# Altium schematic sheet ESP32-C3 Module.SchDoc
size A3; Author: Alptron AB; CompanyName: Alptron AB; DrawnBy: Caner Alp; Engineer: Caner Alp; Organization: Alptron AB; Address2: Vaesteas; Address4: Sweden; DocumentNumber: 2; SheetNumber: 2; SheetTotal: 5
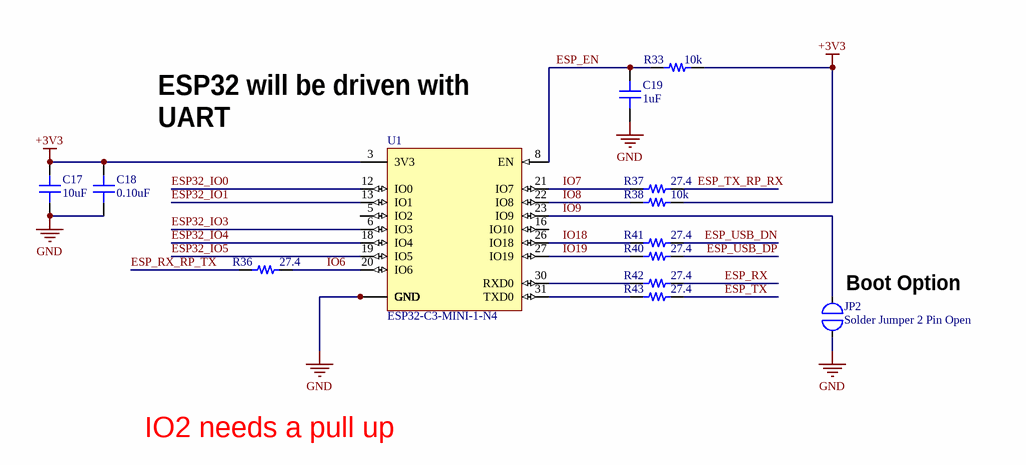
[diagram p0: ESP32-C3 Module.SchDoc]

## Parts
C17  10uF  [CAP 0603/1608]
C18  0.10uF  [CAP 0402/1005]
C19  1uF  [CAP 0402/1005]
JP2  Solder Jumper 2 Pin Open  [SolderJumper-2_P1.3mm_Open_RoundedPad1.0x1.5mm]  (net tie, no BOM)
R33  10k  [RES 0402/1005]
R36  27.4  [RES 0402/1005]
R37  27.4  [RES 0402/1005]
R38  10k  [RES 0402/1005]
R40  27.4  [RES 0402/1005]
R41  27.4  [RES 0402/1005]
R42  27.4  [RES 0402/1005]
R43  27.4  [RES 0402/1005]
U1  ESP32-C3-MINI-1-N4  [XCVR_ESP32-C3-MINI-1-N4]

## Nets
+3V3: C17.2 C18.2 R33.2 R38.2 U1.3(3V3)
GND: C17.1 C18.1 C19.1 JP2.1(A) U1.1(GND) U1.2(GND) U1.11(GND) U1.14(GND) U1.36(GND) U1.37(GND) U1.38(GND) U1.39(GND) U1.40(GND) U1.41(GND) U1.42(GND) U1.43(GND) U1.44(GND) U1.45(GND) U1.46(GND) U1.47(GND) U1.48(GND) U1.49_1(GND) U1.49_2(GND) U1.49_3(GND) U1.49_4(GND) U1.49_5(GND) U1.49_6(GND) U1.49_7(GND) U1.49_8(GND) U1.49_9(GND) U1.50(GND) U1.51(GND) U1.52(GND) U1.53(GND)
ESP32_IO0: U1.12(IO0)
ESP32_IO1: U1.13(IO1)
ESP32_IO3: U1.6(IO3)
ESP32_IO4: U1.18(IO4)
ESP32_IO5: U1.19(IO5)
ESP_EN: C19.2 R33.1 U1.8(EN)
ESP_RX: R42.2
ESP_RX_RP_TX: R36.1
ESP_TX: R43.2
ESP_TX_RP_RX: R37.2
ESP_USB_DN: R41.2
ESP_USB_DP: R40.2
IO6: R36.2 U1.20(IO6)
IO7: R37.1 U1.21(IO7)
IO8: R38.1 U1.22(IO8)
IO9: JP2.2(B) U1.23(IO9)
IO18: R41.1 U1.26(IO18)
IO19: R40.1 U1.27(IO19)
NetR42_1: R42.1 U1.30(RXD0)
NetR43_1: R43.1 U1.31(TXD0)

Not connected (* = marked no-connect by the designer): U1 4(NC) 5(IO2) 7(NC) 9(NC) 10(NC) 15(NC) 16(IO10) 17(NC) 24(NC) 25(NC) 28(NC) 29(NC) 32(NC) 33(NC) 34(NC) 35(NC)

## Notes on the sheet
- (near U1) ESP32 will be driven with UART
- (near JP2) Boot Option
- IO2 needs a pull up
- Title:
- Project:
- Document Number:
- Variant:
- Revision:
- Drawn By:
- Date:
- Sheet
- of
- Size:
- A3

## Library data of the parts
C17 = GRM188R60J106ME47D: CAP CER 10UF 6.3V X5R 0603; Manufacturer: Murata Electronics North America; TemperatureRange: -55C ~ 85C; Tolerance: 20%; Value: 10uF; Part Number: GRM188R60J106ME47D; PartId: 12950; Supplier 1: Digi-Key; Supplier Part Number 1: 490-3896-2-ND; ComponentLink1Description: Datasheet; ComponentLink1URL: http://www.murata.com/~/media/webrenewal/support/library/catalog/products/capacitor/mlcc/c02e.pdf; ComponentLink2Description: Digi-Key Listing; ComponentLink2URL: https://www.digikey.com/product-detail/en/murata-electronics-north-america/GRM188R60J106ME47D/490-3896-2-ND/965910; TemperatureCoefficient: X5R; Voltage: 6.3V; Price: 0,031; Device Package: 0603 (1608 Metric)
C18 = LMK105BJ104KV-F: CAP CER 0.1UF 10V X5R 0402; Manufacturer: Taiyo Yuden; TemperatureRange: -55C ~ 85C; Tolerance: 10%; Value: 0.10uF; Part Number: LMK105BJ104KV-F; PartId: 12322; Supplier 1: Digi-Key; Supplier Part Number 1: 587-1227-2-ND; ComponentLink1Description: Datasheet; ComponentLink1URL: http://ds.yuden.co.jp/TYCOMPAS/ut/detail.do?productNo=LMK105BJ104KV-F&fileName=LMK105BJ104KV-F_SS&mode=specSheetDownload; ComponentLink2Description: Digi-Key Listing; ComponentLink2URL: https://www.digikey.com/product-detail/en/taiyo-yuden/LMK105BJ104KV-F/587-1227-2-ND/930579; TemperatureCoefficient: X5R; Voltage: 10V; Price: 0,0021; Device Package: 0402 (1005 Metric)
C19 = GRM155R70J105KA12D: CAP CER 1UF 6.3V X7R 0402; Manufacturer: Murata Electronics North America; TemperatureRange: -55C ~ 125C; Tolerance: 10%; Type: Derating Recommended; Value: 1uF; Part Number: GRM155R70J105KA12D; PartId: 5157; Supplier 1: Digi-Key; Supplier Part Number 1: 490-10024-2-ND; ComponentLink1Description: Datasheet; ComponentLink1URL: http://www.murata.com/~/media/webrenewal/support/library/catalog/products/capacitor/mlcc/c02e.ashx; ComponentLink2Description: Digi-Key listing; ComponentLink2URL: http://digikey.com/product-detail/en/GRM155R70J105KA12D/490-10024-2-ND/5027109; TemperatureCoefficient: X7R; Voltage: 6.3V; Price: 0,019; Device Package: 0402 (1005 Metric)
JP2 = SolderJumper_2_Open: ki_keywords: solder jumper SPST; ki_description: Solder Jumper, 2-pole, open; ki_fp_filters: SolderJumper*Open*; Supplier: ~
R33 R38 = RC0402JR-0710KL: RES SMD 10K OHM 5% 1/16W 0402; Manufacturer: Yageo; TemperatureRange: -55C ~ 155C; TemperatureCoefficient: 100ppm/C; PowerRating: 0.063W, 1/16W; Value: 10k; Part Number: RC0402JR-0710KL; PartId: 14464; Supplier 1: Digi-Key; Supplier Part Number 1: 311-10KJRTR-ND; ComponentLink1Description: Datasheet; ComponentLink1URL: http://www.yageo.com/documents/recent/PYu-RC_Group_51_RoHS_L_04.pdf; ComponentLink2Description: Digi-Key Listing; ComponentLink2URL: https://www.digikey.com/product-detail/en/yageo/RC0402JR-0710KL/311-10KJRTR-ND/726418; Tolerance: 5%; Price: 0,0017; Device Package: 0402 (1005 Metric)
R36 R37 R40-R43 = ERJ-2RKF27R4X: RES SMD 27.4 OHM 1% 1/10W 0402; Manufacturer: Panasonic Electronic Components; TemperatureRange: -55C ~ 155C; TemperatureCoefficient: 100ppm/C; PowerRating: 0.1W, 1/10W; Value: 27.4; Part Number: ERJ-2RKF27R4X; PartId: 342; Supplier 1: Digi-Key; Supplier Part Number 1: P27.4LTR-ND; ComponentLink1Description: Datasheet; ComponentLink1URL: http://industrial.panasonic.com/www-cgi/jvcr13pz.cgi?E+PZ+3+AOA0002+ERJ2RKF27R4X+7+WW; ComponentLink2Description: Digikey listing; ComponentLink2URL: http://digikey.com/product-detail/en/ERJ-2RKF27R4X/P27.4LTR-ND/192262; Tolerance: 1%; Price: 0,0043; Type: Thick Film; Device Package: 0402 (1005 Metric)
U1 = ESP32-C3-MINI-1-N4: Bluetooth, WiFi 802.11b/g/n, Bluetooth v5.0 Transceiver Module 2.412GHz ~ 2.484GHz PCB Trace Surface Mount; MF: Espressif Systems; Purchase-URL: https://pricing.snapeda.com/search/part/ESP32-C3-MINI-1-N4/?ref=eda; Value: *; Package: SMD-53 Espressif Systems; Check_prices: https://www.snapeda.com/parts/ESP32-C3-MINI-1-N4/Espressif+Systems/view-part/?ref=eda; Price: None; Availability: In Stock; MP: ESP32-C3-MINI-1-N4; SnapEDA_Link: https://www.snapeda.com/parts/ESP32-C3-MINI-1-N4/Espressif+Systems/view-part/?ref=snap